# EAGLE schematic airball_sensor_board_v4 (EAGLE 8.7.0)

## Sheet 1 of 3
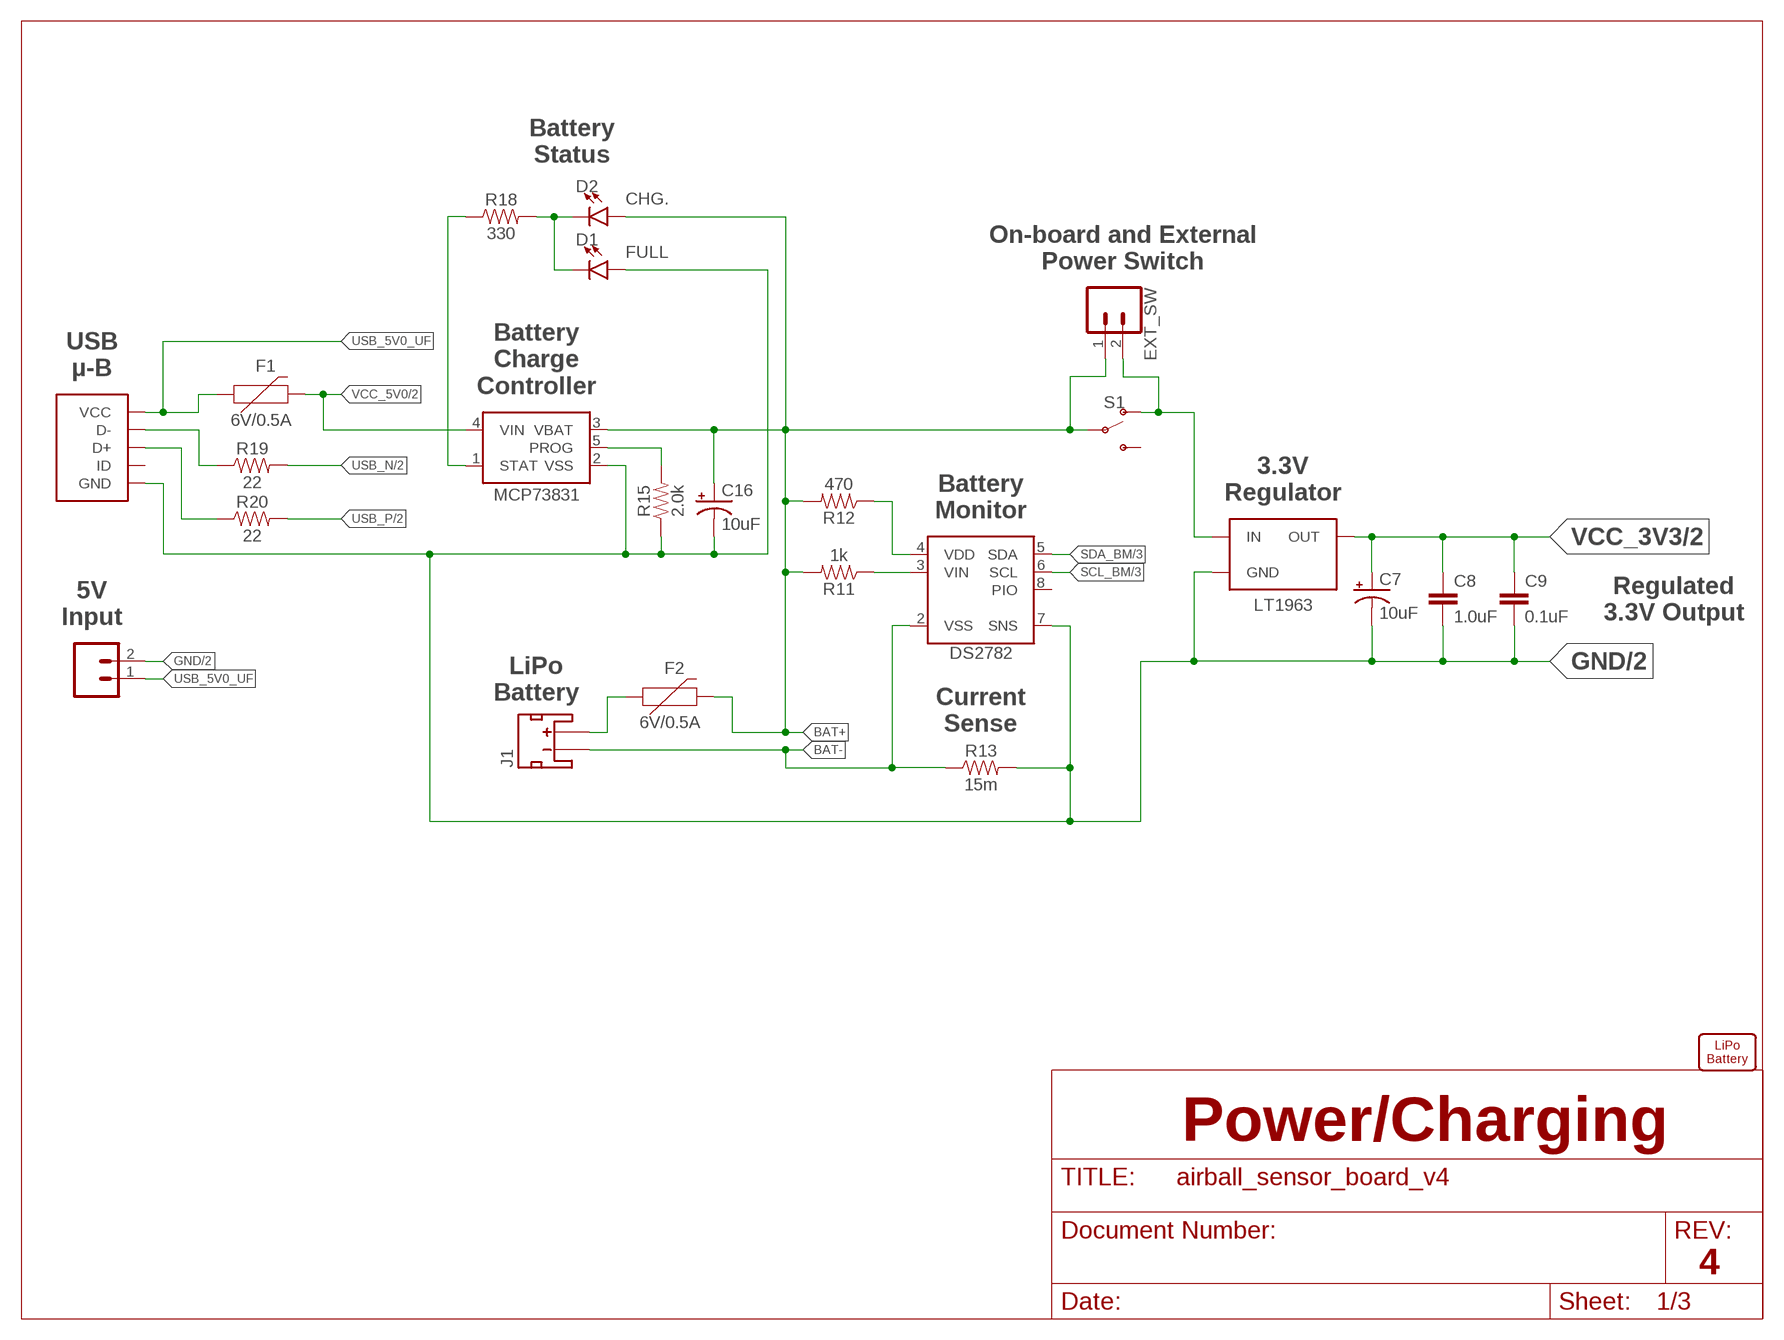
[diagram p0: schematic, sheet 1]

### Parts
BM  DS2782  [TSSOP8]
C7  10uF  10UF-POLAR-EIA3216-16V-10%(TANT)  [EIA3216]
C8  1.0uF  1.0UF-0603-16V-10%  [0603]
C9  0.1uF  0.1UF-0603-25V-5%  [0603]
C16  10uF  10UF-POLAR-EIA3216-16V-10%(TANT)  [EIA3216]
CC  MCP73831  [SOT23-5]
D1  LED0603  [LED-0603]
D2  LED0603  [LED-0603]
EXT_POWER  CONN_02  [1X02]
EXT_SW  CONN_02  [1X02]
F1  6V/0.5A  PPTC_HALF-AMP  [1206]
F2  6V/0.5A  PPTC_HALF-AMP  [1206]
J1  JST_2MM_MALE  [JST-2-SMD]
JP1  USB_MICROB_PLUG  [USB_MICRO_B_TYCO]
R11  1k  1KOHM-0603-1/10W-1%  [0603]
R12  470  470OHM-0603-1/10W-1%  [0603]
R13  15m  RESISTOR1206  [1206]
R15  2.0k  2.0KOHM-0603-1/10W-5%  [0603]
R18  330  330OHM-0603-1/10W-1%  [0603]
R19  22  22OHM-0603-1/10W-1%  [0603]
R20  22  22OHM-0603-1/10W-1%  [0603]
S1  SWITCH-SPDT-SMD-RIGHT-ANGLE  [SWITCH_SPST_SMD_A]
U$3  LIPO_BATTERY_OUTLINE-1000MAH  [SPARKFUN_LIPO_1000MAH]
VREG  LT1963  [SOT223-3]

### Nets
BAT+ [battery]: C16.+ CC.3(VBAT) D2.A EXT_SW.1 F2.2 R11.2 R12.2 S1.2(P)
BAT+_UF [battery]: F2.1 J1.2(+)
BAT- [battery]: BM.2(VSS) J1.1(-) R13.1
BAT_VRAW [battery]: EXT_SW.2 S1.1(O) VREG.1(IN)
BM_VDD [power]: BM.4(VDD) R12.1
BM_VIN [power]: BM.3(VIN) R11.1
CC_PROG: CC.5(PROG) R15.2
CHG_LED: CC.1(STAT) R18.1
GND [power]: BM.7(SNS) C7.- C8.2 C9.2 C16.- CC.2(VSS) D1.A EXT_POWER.2 JP1.5(GND) JP1.SH@1(GND) JP1.SH@2(GND) JP1.SH@3(GND) JP1.SH@4(GND) R13.2 R15.1 VREG.2(GND) VREG.TAB(GND) ; also sheet 2,3
N$1: D1.C D2.C R18.2
SCL_BM: BM.6(SCL) ; also sheet 3
SDA_BM: BM.5(SDA) ; also sheet 3
USB_5V0_UF [battery]: EXT_POWER.1 F1.1 JP1.1(VCC)
USB_N: R19.2 ; also sheet 2
USB_P: R20.2 ; also sheet 2
USB_X_N: JP1.2(D-) R19.1
USB_X_P: JP1.3(D+) R20.1
VCC_3V3 [power]: C7.+ C8.1 C9.1 VREG.3(OUT) ; also sheet 2,3
VCC_5V0 [power]: CC.4(VIN) F1.2 ; also sheet 2
Unconnected: BM.8(PIO) J1.NC1(PAD1) J1.NC2(PAD2) JP1.4(ID) S1.3(S)

### Notes on the sheet
- Battery
  Status
- CHG.
- FULL
- On-board and External
  Power Switch
- USB
  µ-B
- Battery
  Charge
  Controller
- 3.3V
  Regulator
- Battery
  Monitor
- Regulated
  3.3V Output
- 5V
  Input
- LiPo
  Battery
- Current
  Sense
- Power/Charging
- 4

## Sheet 2 of 3
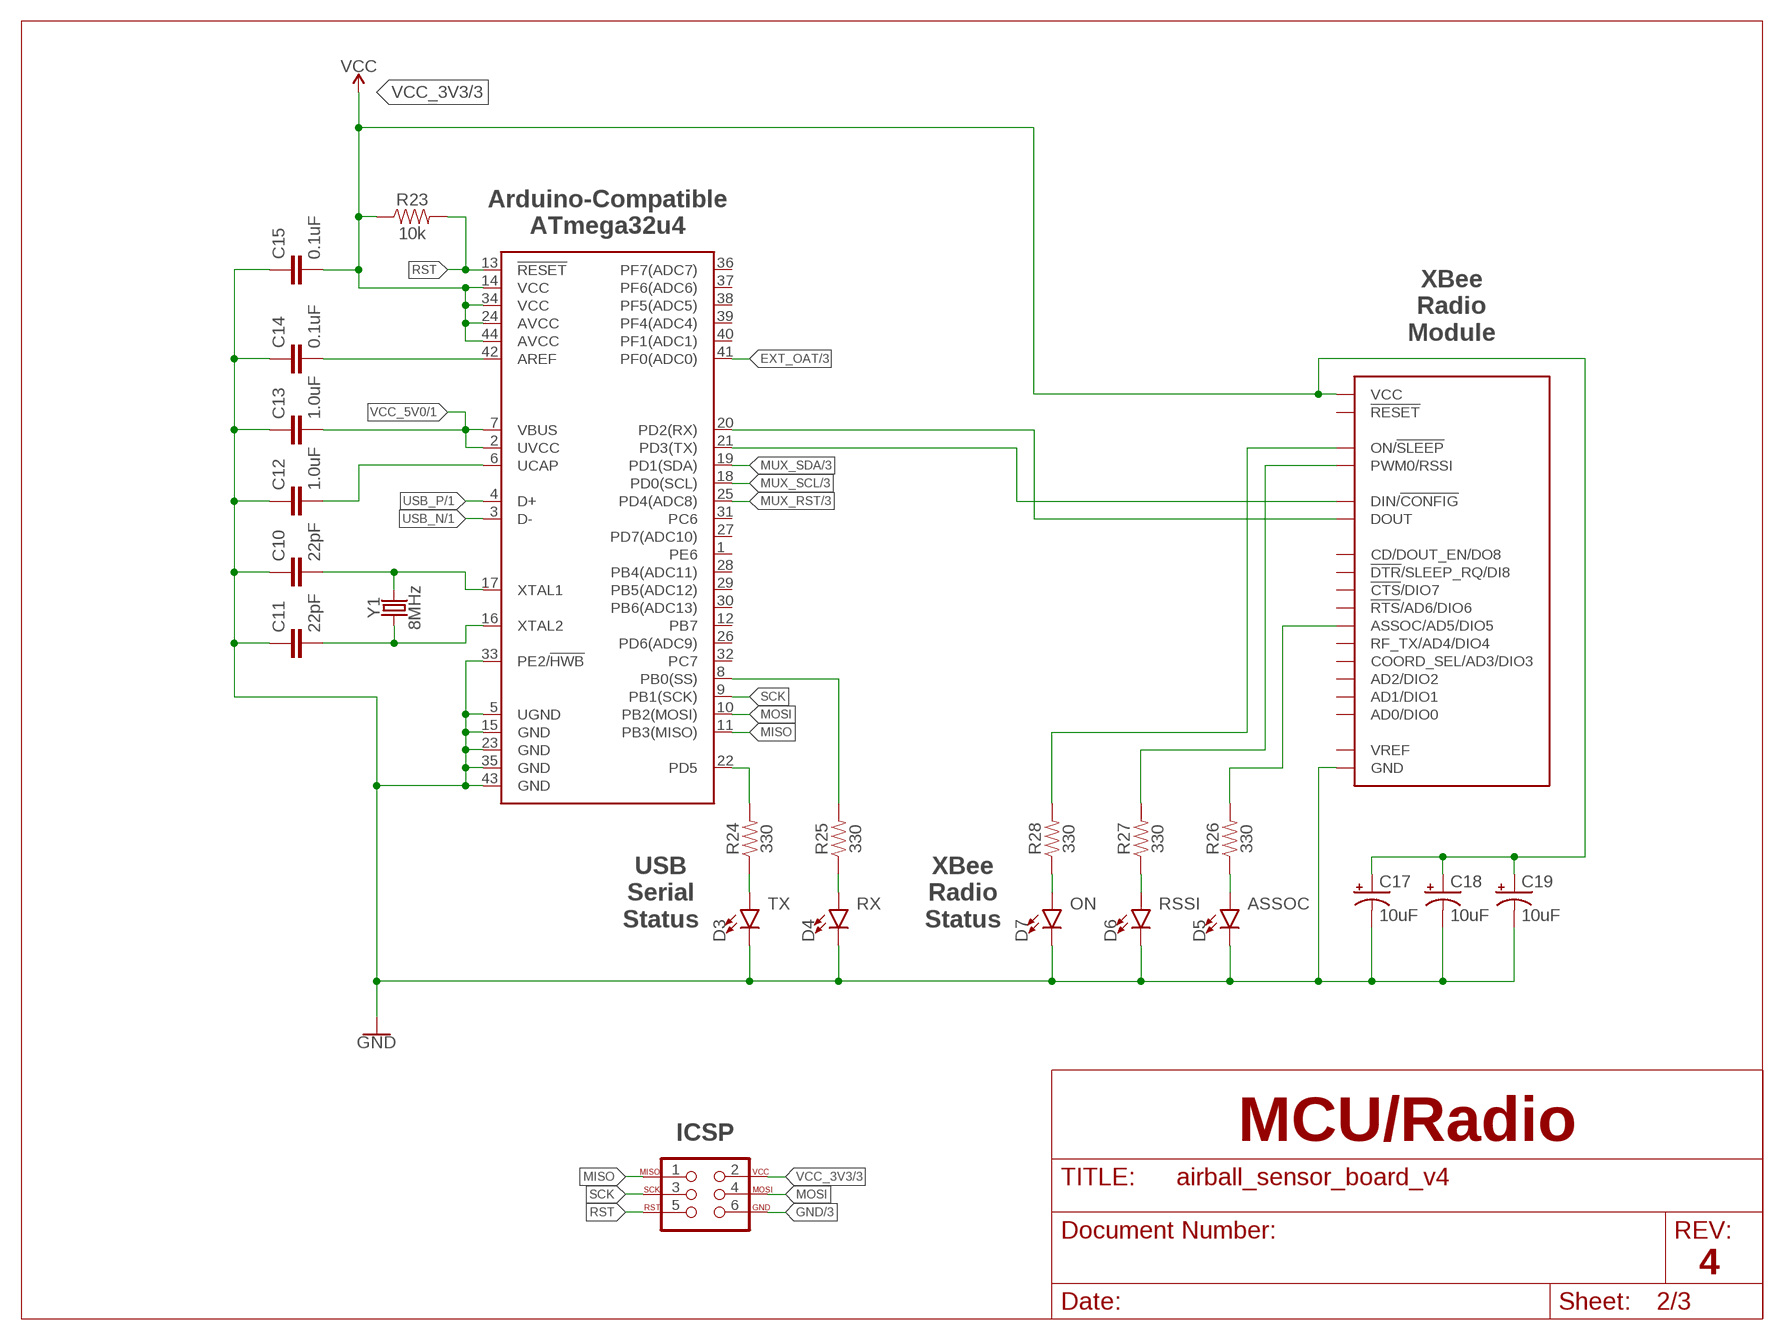
[diagram p1: schematic, sheet 2]

### Parts
C10  22pF  22PF-0603-50V-5%  [0603]
C11  22pF  22PF-0603-50V-5%  [0603]
C12  1.0uF  1.0UF-0603-16V-10%  [0603]
C13  1.0uF  1.0UF-0603-16V-10%  [0603]
C14  0.1uF  0.1UF-0603-25V-5%  [0603]
C15  0.1uF  0.1UF-0603-25V-5%  [0603]
C17  10uF  10UF-POLAR-EIA3216-16V-10%(TANT)  [EIA3216]
C18  10uF  10UF-POLAR-EIA3216-16V-10%(TANT)  [EIA3216]
C19  10uF  10UF-POLAR-EIA3216-16V-10%(TANT)  [EIA3216]
D3  LED0603  [LED-0603]
D4  LED0603  [LED-0603]
D5  LED0603  [LED-0603]
D6  LED0603  [LED-0603]
D7  LED0603  [LED-0603]
ICSP  AVR_SPI_PROG_3X2PTH  [2X3]
MCU  32U4  ATMEGA32U4TQFP-44  [TQFP44]
R23  10k  10KOHM-0603-1/10W-1%  [0603]
R24  330  330OHM-0603-1/10W-1%  [0603]
R25  330  330OHM-0603-1/10W-1%  [0603]
R26  330  330OHM-0603-1/10W-1%  [0603]
R27  330  330OHM-0603-1/10W-1%  [0603]
R28  330  330OHM-0603-1/10W-1%  [0603]
XBEE  XBEE-PRO-SMD  [XBEE-PRO-SMD]
Y1  8MHz  CRYSTAL-8MHZSMD-5X3.2  [CRYSTAL-SMD-5X3.2-4PAD]

### Nets
ASSOC_LED: R26.2 XBEE.15(ASSOC/AD5/DIO5)
EXT_OAT: MCU.41(PF0(ADC0)) ; also sheet 3
GND [power]: C10.1 C11.1 C12.1 C13.1 C14.1 C15.1 C17.- C18.- C19.- D3.C D4.C D5.C D6.C D7.C ICSP.6 MCU.5(UGND) MCU.15(GND) MCU.23(GND) MCU.33(PE2/!HWB) MCU.35(GND) MCU.43(GND) XBEE.10(GND) ; also sheet 1,3
MISO: ICSP.1 MCU.11(PB3(MISO))
MOSI: ICSP.4 MCU.10(PB2(MOSI))
MUX_RST: MCU.25(PD4(ADC8)) ; also sheet 3
MUX_SCL: MCU.18(PD0(SCL)) ; also sheet 3
MUX_SDA: MCU.19(PD1(SDA)) ; also sheet 3
N$6: C10.2 MCU.17(XTAL1) Y1.3
N$7: C11.2 MCU.16(XTAL2) Y1.1
N$10: D3.A R24.1
N$12: C14.2 MCU.42(AREF)
N$14: D4.A R25.1
N$16: C12.2 MCU.6(UCAP)
N$20: D5.A R26.1
N$21: D6.A R27.1
N$22: D7.A R28.1
ON_LED: R28.2 XBEE.13(ON/!SLEEP)
RSSI_LED: R27.2 XBEE.6(PWM0/RSSI)
RST: ICSP.5 MCU.13(!RESET) R23.2
RX_LED: MCU.8(PB0(SS)) R25.2
RXD: MCU.20(PD2(RX)) XBEE.2(DOUT)
SCK: ICSP.3 MCU.9(PB1(SCK))
TX_LED: MCU.22(PD5) R24.2
TXD: MCU.21(PD3(TX)) XBEE.3(DIN/!CONFIG)
USB_N: MCU.3(D-) ; also sheet 1
USB_P: MCU.4(D+) ; also sheet 1
VCC_3V3 [power]: C15.2 C17.+ C18.+ C19.+ ICSP.2 MCU.14(VCC) MCU.24(AVCC) MCU.34(VCC) MCU.44(AVCC) R23.1 XBEE.1(VCC) ; supply symbol labelled VCC ; also sheet 1,3
VCC_5V0 [power]: C13.2 MCU.2(UVCC) MCU.7(VBUS) ; also sheet 1
Unconnected: MCU.1(PE6) MCU.12(PB7) MCU.26(PD6(ADC9)) MCU.27(PD7(ADC10)) MCU.28(PB4(ADC11)) MCU.29(PB5(ADC12)) MCU.30(PB6(ADC13)) MCU.31(PC6) MCU.32(PC7) MCU.36(PF7(ADC7)) MCU.37(PF6(ADC6)) MCU.38(PF5(ADC5)) MCU.39(PF4(ADC4)) MCU.40(PF1(ADC1)) XBEE.4(CD/DOUT_EN/DO8) XBEE.5(!RESET) XBEE.9(!DTR!/SLEEP_RQ/DI8) XBEE.11(RF_TX/AD4/DIO4) XBEE.12(!CTS!/DIO7) XBEE.14(VREF) XBEE.16(!RTS!/AD6/DIO6) XBEE.17(COORD_SEL/AD3/DIO3) XBEE.18(AD2/DIO2) XBEE.19(AD1/DIO1) XBEE.20(AD0/DIO0)

### Notes on the sheet
- Arduino-Compatible
  ATmega32u4
- XBee
  Radio
  Module
- TX | RX | ON | RSSI | ASSOC
- USB
  Serial
  Status
- XBee
  Radio
  Status
- ICSP | MCU/Radio
- 4

## Sheet 3 of 3
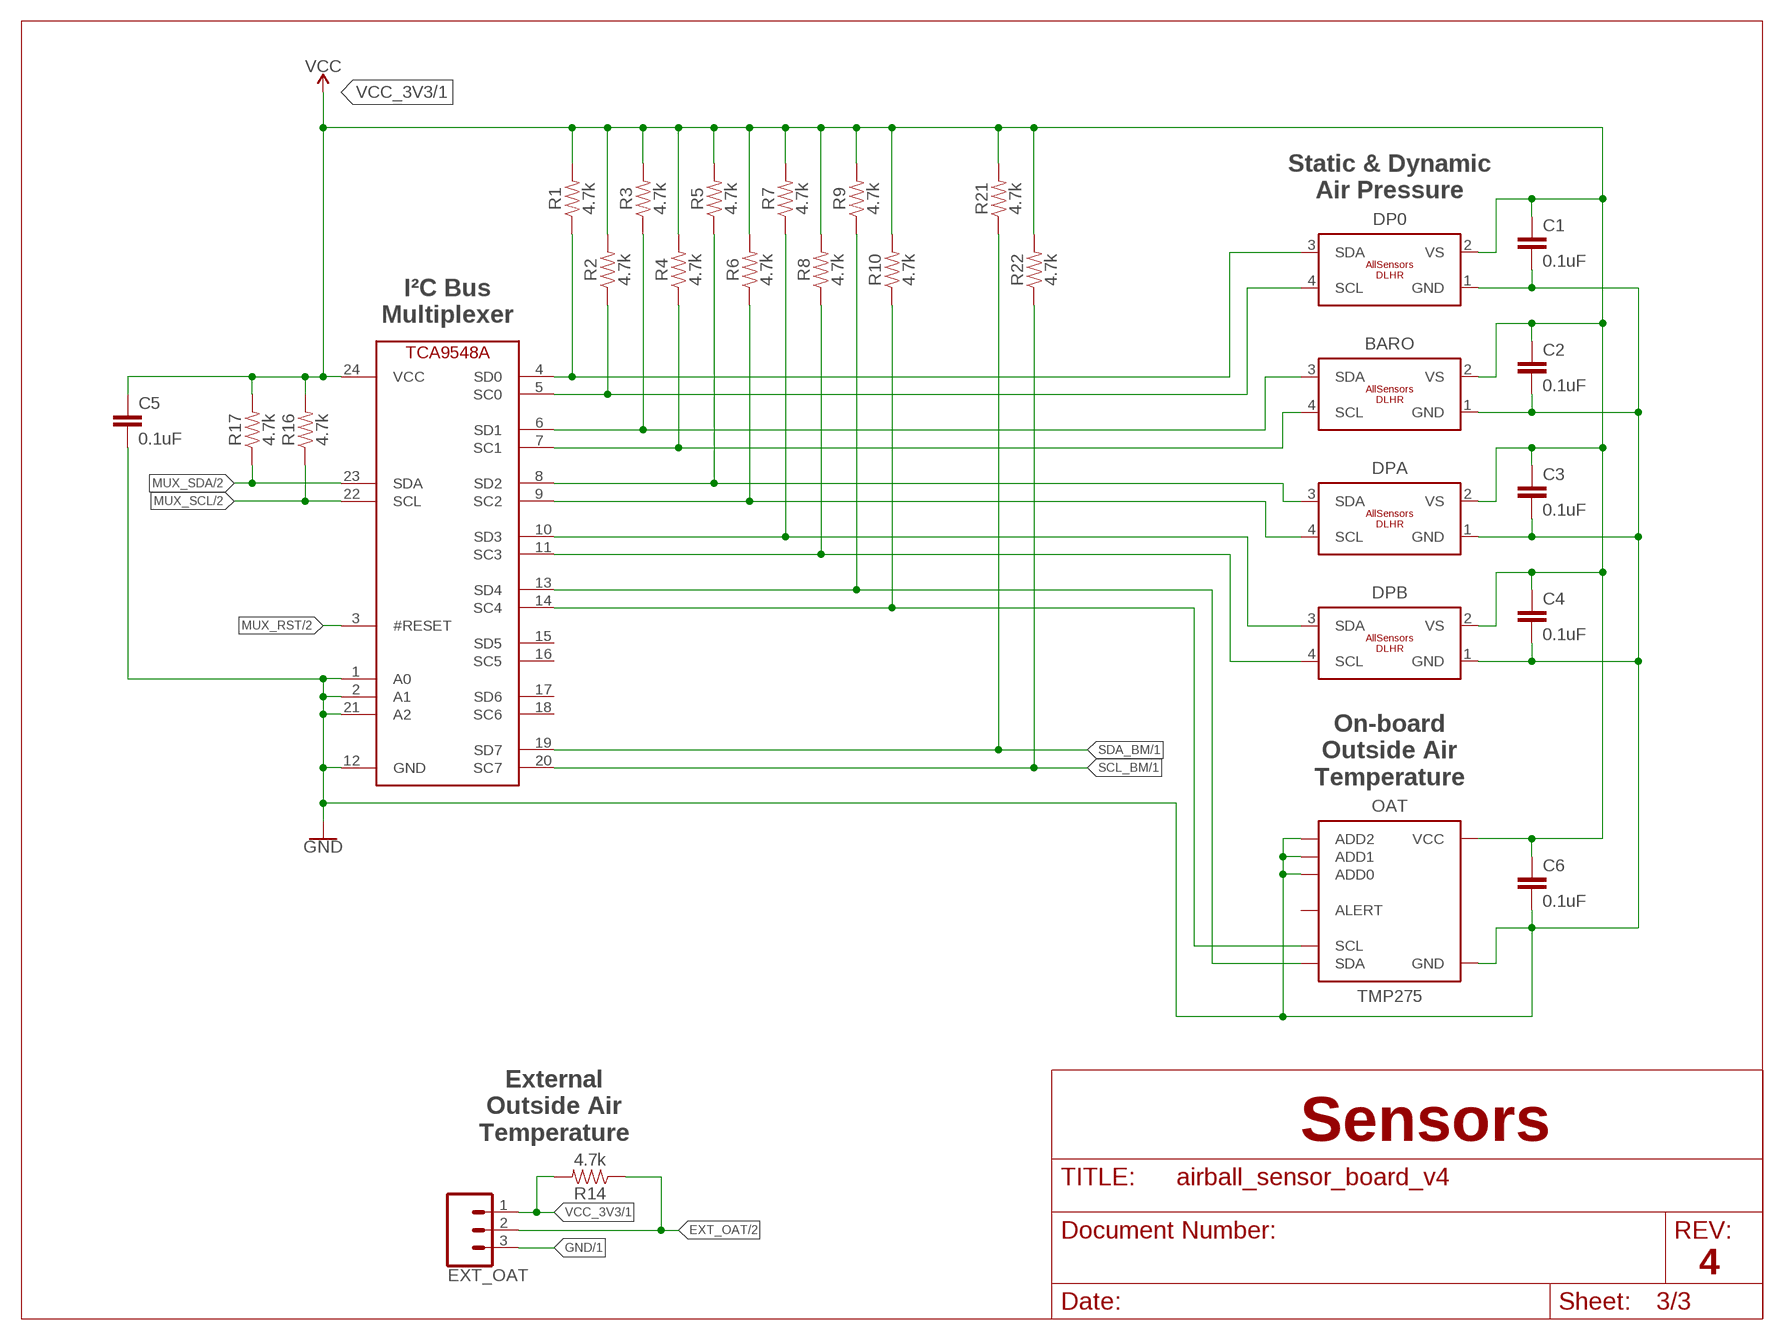
[diagram p2: schematic, sheet 3]

### Parts
BARO  ALLSENSORS_DLHR_I2C-E1BD  [ALLSENSORS_E1BD]
C1  0.1uF  0.1UF-0603-25V-5%  [0603]
C2  0.1uF  0.1UF-0603-25V-5%  [0603]
C3  0.1uF  0.1UF-0603-25V-5%  [0603]
C4  0.1uF  0.1UF-0603-25V-5%  [0603]
C5  0.1uF  0.1UF-0603-25V-5%  [0603]
C6  0.1uF  0.1UF-0603-25V-5%  [0603]
DP0  ALLSENSORS_DLHR_I2C-E1BD  [ALLSENSORS_E1BD]
DPA  ALLSENSORS_DLHR_I2C-E1BD  [ALLSENSORS_E1BD]
DPB  ALLSENSORS_DLHR_I2C-E1BD  [ALLSENSORS_E1BD]
EXT_OAT  CONN_03  [1X03]
MUX  TCA9548ATSSOP24  [TSSOP24]
OAT  TMP275  LM75-8PIN  [SOIC8]
R1  4.7k  4.7KOHM-0603-1/10W-1%  [0603]
R2  4.7k  4.7KOHM-0603-1/10W-1%  [0603]
R3  4.7k  4.7KOHM-0603-1/10W-1%  [0603]
R4  4.7k  4.7KOHM-0603-1/10W-1%  [0603]
R5  4.7k  4.7KOHM-0603-1/10W-1%  [0603]
R6  4.7k  4.7KOHM-0603-1/10W-1%  [0603]
R7  4.7k  4.7KOHM-0603-1/10W-1%  [0603]
R8  4.7k  4.7KOHM-0603-1/10W-1%  [0603]
R9  4.7k  4.7KOHM-0603-1/10W-1%  [0603]
R10  4.7k  4.7KOHM-0603-1/10W-1%  [0603]
R14  4.7k  4.7KOHM-0603-1/10W-1%  [0603]
R16  4.7k  4.7KOHM-0603-1/10W-1%  [0603]
R17  4.7k  4.7KOHM-0603-1/10W-1%  [0603]
R21  4.7k  4.7KOHM-0603-1/10W-1%  [0603]
R22  4.7k  4.7KOHM-0603-1/10W-1%  [0603]

### Nets
EXT_OAT: EXT_OAT.2 R14.1 ; also sheet 2
GND [power]: BARO.1(GND) C1.2 C2.2 C3.2 C4.2 C5.2 C6.2 DP0.1(GND) DPA.1(GND) DPB.1(GND) EXT_OAT.3 MUX.1(A0) MUX.2(A1) MUX.12(GND) MUX.21(A2) OAT.4(GND) OAT.5(ADD2) OAT.6(ADD1) OAT.7(ADD0) ; also sheet 1,2
MUX_RST: MUX.3(#RESET) ; also sheet 2
MUX_SCL: MUX.22(SCL) R16.1 ; also sheet 2
MUX_SDA: MUX.23(SDA) R17.1 ; also sheet 2
SCL_BARO: BARO.4(SCL) MUX.7(SC1) R4.1
SCL_BM: MUX.20(SC7) R22.1 ; also sheet 1
SCL_DP0: DP0.4(SCL) MUX.5(SC0) R2.1
SCL_DPA: DPA.4(SCL) MUX.9(SC2) R6.1
SCL_DPB: DPB.4(SCL) MUX.11(SC3) R8.1
SCL_OAT: MUX.14(SC4) OAT.2(SCL) R10.1
SDA_BARO: BARO.3(SDA) MUX.6(SD1) R3.1
SDA_BM: MUX.19(SD7) R21.1 ; also sheet 1
SDA_DP0: DP0.3(SDA) MUX.4(SD0) R1.1
SDA_DPA: DPA.3(SDA) MUX.8(SD2) R5.1
SDA_DPB: DPB.3(SDA) MUX.10(SD3) R7.1
SDA_OAT: MUX.13(SD4) OAT.1(SDA) R9.1
VCC_3V3 [power]: BARO.2(VS) C1.1 C2.1 C3.1 C4.1 C5.1 C6.1 DP0.2(VS) DPA.2(VS) DPB.2(VS) EXT_OAT.1 MUX.24(VCC) OAT.8(VCC) R1.2 R2.2 R3.2 R4.2 R5.2 R6.2 R7.2 R8.2 R9.2 R10.2 R14.2 R16.2 R17.2 R21.2 R22.2 ; supply symbol labelled VCC ; also sheet 1,2
Unconnected: MUX.15(SD5) MUX.16(SC5) MUX.17(SD6) MUX.18(SC6) OAT.3(ALERT)

### Notes on the sheet
- Static & Dynamic
  Air Pressure
- I²C Bus
  Multiplexer
- On-board
  Outside Air
  Temperature
- External
  Outside Air
  Temperature
- Sensors
- 4

## Library data of the parts
BARO DP0 DPA DPB = airball:ALLSENSORS_DLHR_I2C
BM = airball:DS2782
C1-C6 C9 C14 C15 = SparkFun-Capacitors:0.1UF: 0.1µF ceramic capacitors A capacitor is a passive two-terminal electrical component used to store electrical energy temporarily in an electric field.; PROD_ID: CAP-08604
C7 C16-C19 = SparkFun-Capacitors:10UF-POLAR: 10.0µF polarized capacitors A capacitor is a passive two-terminal electrical component used to store electrical energy temporarily in an electric field.; PROD_ID: CAP-00811
C8 C12 C13 = SparkFun-Capacitors:1.0UF: 1µF ceramic capacitors A capacitor is a passive two-terminal electrical component used to store electrical energy temporarily in an electric field.; PROD_ID: CAP-00868
C10 C11 = SparkFun-Capacitors:22PF: 22pF ceramic capacitors A capacitor is a passive two-terminal electrical component used to store electrical energy temporarily in an electric field.; PROD_ID: CAP-07876
CC = SparkFun-IC-Power:MCP73831: MCP73831T Li-Ion, Li-Pol Controller Miniature single cell, fully integrated Li-Ion, Li-polymer charge management controller Datasheet <http://ww1.microchip.com/downloads/en/DeviceDoc/20001984g.pdf> SparkFun Products: SparkFun ESP32 Thing <https://www.sparkfun.com/products/13907> SparkFun 9DoF Razor IMU M0 <https://www.sparkfun.com/products/14001>; PROD_ID: IC-09995
D1-D7 = SparkFun-LED:LED: LED (Generic) Standard schematic elements and footprints for 5mm, 3mm, 1206, and 0603 sized LEDs. Generic LEDs with no color specified.
EXT_OAT = SparkFun-Connectors:CONN_03: Multi connection point. Often used as Generic Header-pin footprint for 0.1 inch spaced/style header connections On any of the 0.1 inch spaced packages, you can populate with these: Break Away Headers - Straight <https://www.sparkfun.com/products/116> (PRT-00116) Break Away Male Headers - Right Angle <https://www.sparkfun.com/products/553> (PRT-00553) Female Headers <https://www.sparkfun.com/products/115> (PRT-00115) Break Away Headers - Machine Pin <https://www.sparkfun.com/products/117> (PRT-00117) Break Away Female Headers - Swiss Machine Pin <https://www.sparkfun.com/products/743> (PRT-00743) Stackable Header - 3 Pin (Female, 0.1") <https://www.sparkfun.com/products/13875> (PRT-13875) For SCREWTERMINALS and SPRING TERMINALS visit here: Screw Terimnals on SparkFun.com <https://www.sparkfun.com/search/results?term=Screw+Terminals> (5mm/3.5mm/2.54mm spacing) This device is also useful as a general connection point to wire up your design to another part of your project. Our various solder wires solder well into these plated through hole pads. Hook-Up Wire - Assortment (Stranded, 22 AWG) <https://www.sparkfun.com/products/11375> (PRT-11375) Hook-Up Wire - Assortment (Solid Core, 22 AWG) <https://www.sparkfun.com/products/11367> (PRT-11367) View the entire wire category on our website here <https://www.sparkfun.com/categories/141> Special notes: Molex polarized connector foot print use with SKU : PRT-08232 with associated crimp pins and housings.; PROD_ID: XXX-00000; VALUE: 455-1750-1-ND
EXT_POWER EXT_SW = SparkFun-Connectors:CONN_02: Multi connection point. Often used as Generic Header-pin footprint for 0.1 inch spaced/style header connections On any of the 0.1 inch spaced packages, you can populate with these: Break Away Headers - Straight <https://www.sparkfun.com/products/116> (PRT-00116) Break Away Male Headers - Right Angle <https://www.sparkfun.com/products/553> (PRT-00553) Female Headers <https://www.sparkfun.com/products/115> (PRT-00115) Break Away Headers - Machine Pin <https://www.sparkfun.com/products/117> (PRT-00117) Break Away Female Headers - Swiss Machine Pin <https://www.sparkfun.com/products/743> (PRT-00743) For SCREWTERMINALS and SPRING TERMINALS visit here: Screw Terimnals on SparkFun.com <https://www.sparkfun.com/search/results?term=Screw+Terminals> (5mm/3.5mm/2.54mm spacing) This device is also useful as a general connection point to wire up your design to another part of your project. Our various solder wires solder well into these plated through hole pads. Hook-Up Wire - Assortment (Stranded, 22 AWG) <https://www.sparkfun.com/products/11375> (PRT-11375) Hook-Up Wire - Assortment (Solid Core, 22 AWG) <https://www.sparkfun.com/products/11367> (PRT-11367) View the entire wire category on our website here <https://www.sparkfun.com/categories/141> Special notes: Molex polarized connector foot print use with: PRT-08233 with associated crimp pins and housings. 2.54_SCREWTERM for use with PRT-10571. 3.5mm Screw Terminal footprints for PRT-08084 5mm Screw Terminal footprints for use with PRT-08432
F1 F2 = SparkFun-Fuses:PPTC: Resettable Fuse PPTC Resettable Fuse. Really a sort of resistor with a polymeric positive temperature coefficient whose resistance increases dramatically with an increase in temperature. When heated by the power passing through the resistance rises causing the current to be limited, protecting the circuit. This is achieved by the transition of the polymer from a crystalline to an amorphous state where the conductive carbon separates breaking the conductive pathways found in the cool crystalline structure. When a PPTC cools back down it resumes conducting letting the circuit turn back on. SparkFun Products: SparkFun RedBoard - Programmed with Arduino <https://www.sparkfun.com/products/12757> Pro Micro - 5V/16MHz <https://www.sparkfun.com/products/12640> Arduino Pro 328 - 5V/16MHz <https://www.sparkfun.com/products/10915> MP3 Trigger <https://www.sparkfun.com/products/13720>; PROD_ID: RES-08585
ICSP = SparkFun-Connectors:AVR_SPI_PROG_3X2: AVR ISP 6 Pin This is the reduced ISP connector for AVR programming. Common on Arduino. This footprint will take up less PCB space and can be used with a 10-pin to 6-pin adapter such as SKU: BOB-08508 **Special note about "TEST_POINT" package. The stop mask is on the top side, so if you want your programming test points to be on the bottom of your board, make sure to place this package on the bottom side of the board. This also ensure that the orientation to program from the bottom side will be correct. SparkFun Products: SparkFun ISP Pogo Adapter <https://www.sparkfun.com/products/11591> - NS Tiny AVR Programmer <https://www.sparkfun.com/products/11801> -PTH
J1 = SparkFun-Connectors:JST_2MM_MALE: JST 2MM MALE RA CONNECTOR Two pin, compact surface mount connector. Commonly used as a battery input connection point. We really like the solid locking feeling and high current rating on these small connectors. We use these all the time as battery connectors. Mates to single-cell LiPo batteries. Here is the connector we sell at SparkFun: JST Right Angle Connector - White <https://www.sparkfun.com/products/8612> (PRT-08612) Datasheet <http://www.sparkfun.com/datasheets/Prototyping/Connectors/JST-Horizontal.pdf> It was used on these SparkFun products: SparkFun MOSFET Power Controller <https://www.sparkfun.com/products/11214> (PRT-11214) SparkFun Battery Babysitter - LiPo Battery Manager <https://www.sparkfun.com/products/13777> (PRT-13777) And many, many others that required a lipo battery connection.; PROD_ID: CONN-11443; SF_ID: PRT-08612
JP1 = airball:USB_MICROB_PLUG: USB Micro-B Plug Comes in a variety of packages. Check out Hirose's ZX-x0 line: http://www.hirose.co.jp/cataloge_hp/e24200011.pdf
MCU = jcole:ATMEGA32U4: Atmel MCU, 32KByte Atmel 44-pin 8-bit Microcontroller with 32KBytes of ISP Flash and USB Controller Datasheet <http://cdn.sparkfun.com/datasheets/Dev/Arduino/Boards/ATMega32U4.pdf> SparkFun Products LilyPad Arduino USB - ATmega32U4 Board <https://www.sparkfun.com/products/12049> (DEV-12049) Pro Micro - 5V/16MHz <https://www.sparkfun.com/products/12640> (DEV-12640) Pro Micro - 3.3V/8MHz <https://www.sparkfun.com/products/12587> (DEV-12587) Fio v3 - ATmega32U4 <https://www.sparkfun.com/products/11520> (DEV-11520) Qduino Mini <https://www.sparkfun.com/products/13614> (DEV-13614) Makey Makey - Standard Kit <https://www.sparkfun.com/products/11511> (WIG-11511) Makey Makey Deluxe Kit <https://www.sparkfun.com/products/11519> (WIG-11519); PROD_ID: IC-11161
MUX = airball:TCA9548A: Texas Instruments TCA9548A 1-to-8 I2C multiplexer. Supported packages: TSSOP24
OAT = airball:LM75-8PIN
R1-R10 R14 R16 R17 R21 R22 = SparkFun-Resistors:4.7KOHM: 4.7kΩ resistor A resistor is a passive two-terminal electrical component that implements electrical resistance as a circuit element. Resistors act to reduce current flow, and, at the same time, act to lower voltage levels within circuits. - Wikipedia; PROD_ID: RES-07857
R11 = SparkFun-Resistors:1KOHM: 1kΩ resistor A resistor is a passive two-terminal electrical component that implements electrical resistance as a circuit element. Resistors act to reduce current flow, and, at the same time, act to lower voltage levels within circuits. - Wikipedia; PROD_ID: RES-07856
R12 = SparkFun-Resistors:470OHM: 470Ω resistor A resistor is a passive two-terminal electrical component that implements electrical resistance as a circuit element. Resistors act to reduce current flow, and, at the same time, act to lower voltage levels within circuits. - Wikipedia; PROD_ID: RES-07869
R13 = SparkFun-Resistors:RESISTOR: Generic Resistor Package
R15 = SparkFun-Resistors:2.0KOHM: 2kΩ resistor A resistor is a passive two-terminal electrical component that implements electrical resistance as a circuit element. Resistors act to reduce current flow, and, at the same time, act to lower voltage levels within circuits. - Wikipedia; PROD_ID: RES-08296
R18 R24-R28 = SparkFun-Resistors:330OHM: 330Ω resistor A resistor is a passive two-terminal electrical component that implements electrical resistance as a circuit element. Resistors act to reduce current flow, and, at the same time, act to lower voltage levels within circuits. - Wikipedia; PROD_ID: RES-00818
R19 R20 = SparkFun-Resistors:22OHM: 22Ω resistor A resistor is a passive two-terminal electrical component that implements electrical resistance as a circuit element. Resistors act to reduce current flow, and, at the same time, act to lower voltage levels within circuits. - Wikipedia; PROD_ID: RES-08698
R23 = SparkFun-Resistors:10KOHM: 10kΩ resistor A resistor is a passive two-terminal electrical component that implements electrical resistance as a circuit element. Resistors act to reduce current flow, and, at the same time, act to lower voltage levels within circuits. - Wikipedia; PROD_ID: RES-00824
S1 = SparkFun-Switches:SWITCH-SPDT: Single Pole, Double Throw (SPDT) Switch Single-pole, double-throw (SPDT) switch. Variant Overview SMD-AYZ0202 Surface Mount DPDT Switch <https://www.sparkfun.com/products/597> (COM-00597) Used on e.g. LilyPad Arduino USB - ATmega32U4 Board <https://www.sparkfun.com/products/12049> PTH-11.6X4.0MM SPDT Mini Power Switch <https://www.sparkfun.com/products/102> (COM-00102) Used on e.g. SparkFun Simon Says - Through-Hole Soldering Kit <https://www.sparkfun.com/products/10547> (KIT-10547) PTH-11.6X4.0MM-KIT KIT version of SPDT Mini Power Switch - Simplifies soldering by removing tStop of switch pins - only one side can be soldered. PTH-11.6X4.0MM-LOCK LOCK version of SPDT Mini Power Switch - Offset pins hold switch in place for easier soldering. SMD-RIGHT-ANGLE Surface Mount Right Angle Switch <https://www.sparkfun.com/products/10860> (COM-10860) Used on e.g. SparkFun ESP8266 Thing <https://www.sparkfun.com/products/13231>; PROD_ID: SWCH-10651; SF_SKU: COM-10860
U$3 = airball:LIPO_BATTERY_OUTLINE
VREG = airball:LT1963
XBEE = airball:XBEE: XBee (TM) /XBee-PRO(TM) OEM RF Modules Source: MaxStream, Inc. xbee_productmanual.pdf
Y1 = SparkFun-Clocks:CRYSTAL-8MHZ: 8MHz Crystal Datasheet Example <http://www.futureelectronics.com/en/technologies/electromechanical/timing-devices/crystals/Pages/6008189-ABM3B-8.000MHZ-B2-T.aspx?IM=0> Frequency: 8MHz Frequency Tolerance: ±20ppm Load Capacitance: 18pF SparkFun Products: Pro Micro -3.3V/8MHz <https://www.sparkfun.com/products/12587> WAV Trigger <https://www.sparkfun.com/products/13660>; PROD_ID: XTAL-09431

## Net classes
0 signal: width 0.152 mm
1 power: width 0.305 mm
2 battery: width 0.381 mm